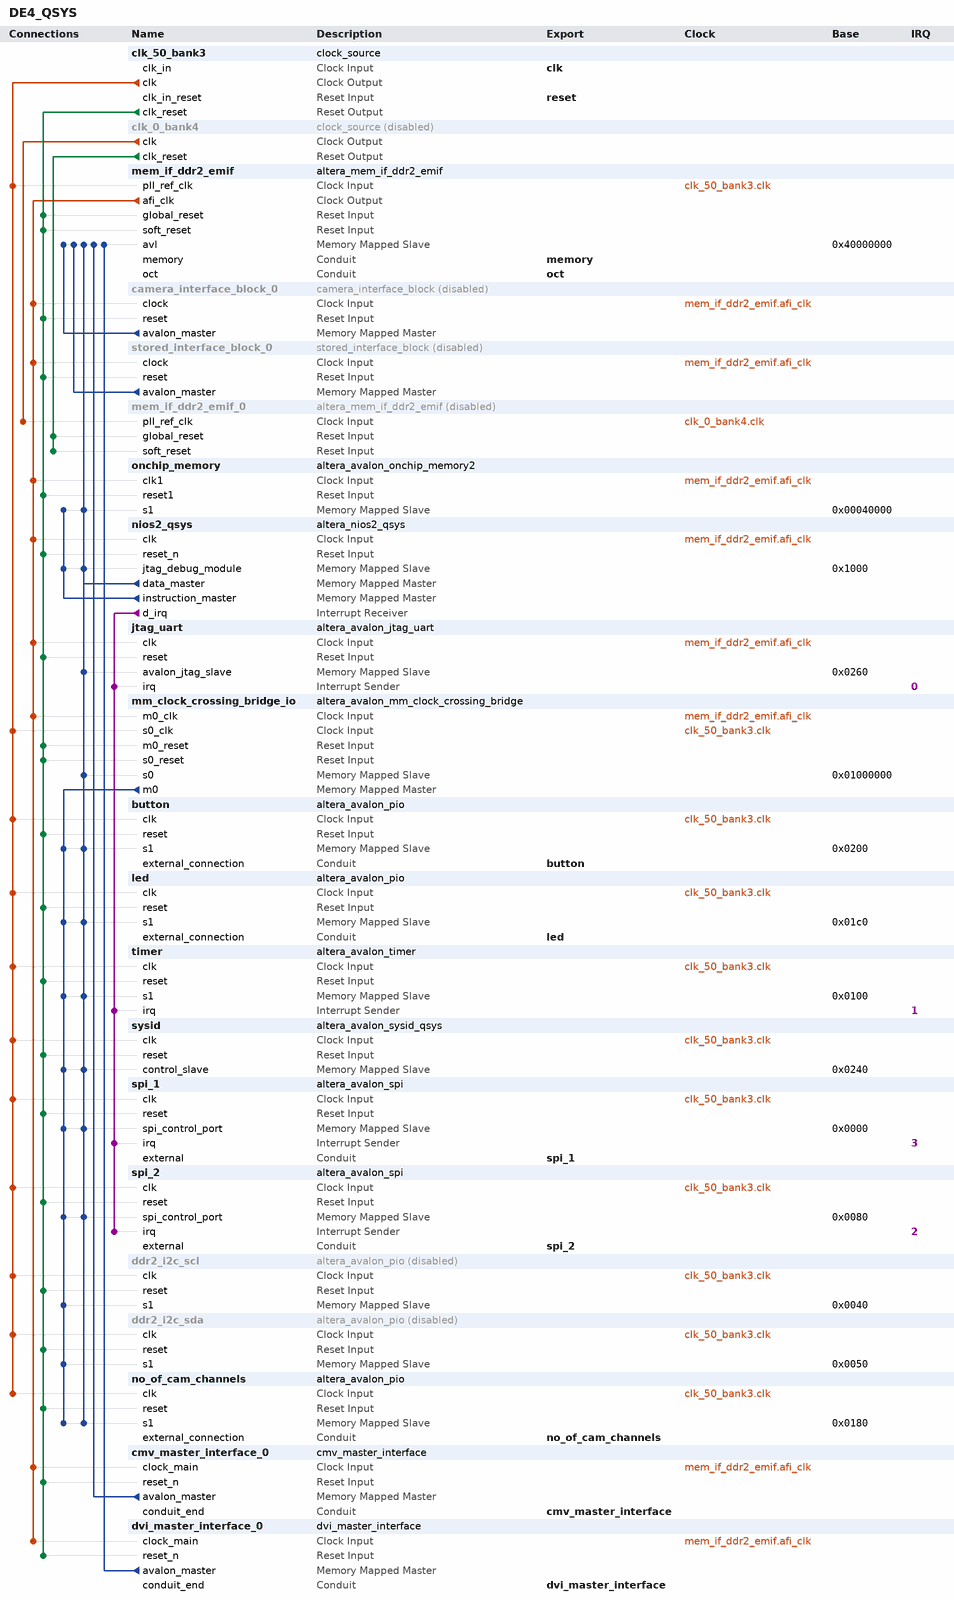
[diagram p0: system contents]
# Platform Designer (Qsys) system DE4_QSYS, Stratix IV EP4SGX230KF40C2
# Parameters at their usual value, and those the tool derives, are not listed.
package require -exact qsys 12.1
create_system DE4_QSYS
set_project_property DEVICE_FAMILY {Stratix IV}
set_project_property DEVICE EP4SGX230KF40C2

add_instance clk_50_bank3 clock_source 12.1
set_instance_parameter_value clk_50_bank3 clockFrequency 50000000

add_instance clk_0_bank4 clock_source 12.1
set_instance_property clk_0_bank4 ENABLED false
set_instance_parameter_value clk_0_bank4 clockFrequency 162000000

add_instance mem_if_ddr2_emif altera_mem_if_ddr2_emif 12.1
set_instance_parameter_value mem_if_ddr2_emif MEM_CLK_FREQ 400.0
set_instance_parameter_value mem_if_ddr2_emif MEM_ROW_ADDR_WIDTH 14
set_instance_parameter_value mem_if_ddr2_emif MEM_COL_ADDR_WIDTH 10
set_instance_parameter_value mem_if_ddr2_emif MEM_DQ_WIDTH 64
set_instance_parameter_value mem_if_ddr2_emif MEM_BANKADDR_WIDTH 3
set_instance_parameter_value mem_if_ddr2_emif MEM_NUMBER_OF_RANKS_PER_DIMM 1
set_instance_parameter_value mem_if_ddr2_emif MEM_TCL 6
set_instance_parameter_value mem_if_ddr2_emif TIMING_TIH 375
set_instance_parameter_value mem_if_ddr2_emif TIMING_TDQSQ 200
set_instance_parameter_value mem_if_ddr2_emif TIMING_TQHS 300
set_instance_parameter_value mem_if_ddr2_emif MEM_TRAS_NS 40.0
set_instance_parameter_value mem_if_ddr2_emif POWER_OF_TWO_BUS true
set_instance_parameter_value mem_if_ddr2_emif AVL_MAX_SIZE 128
set_instance_parameter_value mem_if_ddr2_emif REF_CLK_FREQ 50.0
set_instance_parameter_value mem_if_ddr2_emif DEFAULT_FAST_SIM_MODEL true
set_instance_parameter_value mem_if_ddr2_emif PLL_SHARING_MODE None
set_instance_parameter_value mem_if_ddr2_emif EXPORT_AFI_HALF_CLK false
set_instance_parameter_value mem_if_ddr2_emif CALIBRATION_MODE Full
set_instance_parameter_value mem_if_ddr2_emif USER_DEBUG_LEVEL 0
set_instance_parameter_value mem_if_ddr2_emif DLL_SHARING_MODE None

add_instance camera_interface_block_0 camera_interface_block 1.0
set_instance_property camera_interface_block_0 ENABLED false

add_instance stored_interface_block_0 stored_interface_block 1.0
set_instance_property stored_interface_block_0 ENABLED false

add_instance mem_if_ddr2_emif_0 altera_mem_if_ddr2_emif 12.1
set_instance_property mem_if_ddr2_emif_0 ENABLED false
set_instance_parameter_value mem_if_ddr2_emif_0 MEM_CLK_FREQ 400.0
set_instance_parameter_value mem_if_ddr2_emif_0 MEM_ROW_ADDR_WIDTH 13
set_instance_parameter_value mem_if_ddr2_emif_0 MEM_COL_ADDR_WIDTH 10
set_instance_parameter_value mem_if_ddr2_emif_0 MEM_DQ_WIDTH 64
set_instance_parameter_value mem_if_ddr2_emif_0 MEM_BANKADDR_WIDTH 3
set_instance_parameter_value mem_if_ddr2_emif_0 MEM_NUMBER_OF_RANKS_PER_DIMM 1
set_instance_parameter_value mem_if_ddr2_emif_0 MEM_TCL 6
set_instance_parameter_value mem_if_ddr2_emif_0 TIMING_TIH 375
set_instance_parameter_value mem_if_ddr2_emif_0 TIMING_TDQSQ 200
set_instance_parameter_value mem_if_ddr2_emif_0 TIMING_TQHS 300
set_instance_parameter_value mem_if_ddr2_emif_0 MEM_TRAS_NS 40.0
set_instance_parameter_value mem_if_ddr2_emif_0 POWER_OF_TWO_BUS false
set_instance_parameter_value mem_if_ddr2_emif_0 AVL_MAX_SIZE 4
set_instance_parameter_value mem_if_ddr2_emif_0 REF_CLK_FREQ 100.0
set_instance_parameter_value mem_if_ddr2_emif_0 DEFAULT_FAST_SIM_MODEL true
set_instance_parameter_value mem_if_ddr2_emif_0 PLL_SHARING_MODE None
set_instance_parameter_value mem_if_ddr2_emif_0 EXPORT_AFI_HALF_CLK false
set_instance_parameter_value mem_if_ddr2_emif_0 CALIBRATION_MODE Full
set_instance_parameter_value mem_if_ddr2_emif_0 USER_DEBUG_LEVEL 0
set_instance_parameter_value mem_if_ddr2_emif_0 DLL_SHARING_MODE None

add_instance onchip_memory altera_avalon_onchip_memory2 12.1
set_instance_parameter_value onchip_memory dataWidth 32
set_instance_parameter_value onchip_memory dualPort false
set_instance_parameter_value onchip_memory initMemContent true
set_instance_parameter_value onchip_memory initializationFileName onchip_memory
set_instance_parameter_value onchip_memory memorySize 128000

add_instance nios2_qsys altera_nios2_qsys 12.1
set_instance_parameter_value nios2_qsys manuallyAssignCpuID false
set_instance_parameter_value nios2_qsys resetSlave onchip_memory.s1
set_instance_parameter_value nios2_qsys exceptionSlave onchip_memory.s1
set_instance_parameter_value nios2_qsys breakSlave nios2_qsys.jtag_debug_module
set_instance_parameter_value nios2_qsys muldiv_multiplierType DSPBlock
set_instance_parameter_value nios2_qsys impl Fast
set_instance_parameter_value nios2_qsys icache_size 4096
set_instance_parameter_value nios2_qsys dcache_bursts true

add_instance jtag_uart altera_avalon_jtag_uart 12.1
set_instance_parameter_value jtag_uart allowMultipleConnections true
set_instance_parameter_value jtag_uart simInteractiveOptions INTERACTIVE_ASCII_OUTPUT

add_instance mm_clock_crossing_bridge_io altera_avalon_mm_clock_crossing_bridge 12.1
set_instance_parameter_value mm_clock_crossing_bridge_io DATA_WIDTH 32
set_instance_parameter_value mm_clock_crossing_bridge_io ADDRESS_WIDTH 10
set_instance_parameter_value mm_clock_crossing_bridge_io MAX_BURST_SIZE 1
set_instance_parameter_value mm_clock_crossing_bridge_io COMMAND_FIFO_DEPTH 4
set_instance_parameter_value mm_clock_crossing_bridge_io RESPONSE_FIFO_DEPTH 4
set_instance_parameter_value mm_clock_crossing_bridge_io MASTER_SYNC_DEPTH 2
set_instance_parameter_value mm_clock_crossing_bridge_io SLAVE_SYNC_DEPTH 2

add_instance button altera_avalon_pio 12.1
set_instance_parameter_value button direction Input
set_instance_parameter_value button width 4

add_instance led altera_avalon_pio 12.1
set_instance_parameter_value led direction Output
set_instance_parameter_value led width 8

add_instance timer altera_avalon_timer 12.1
set_instance_parameter_value timer period 1
set_instance_parameter_value timer periodUnits MSEC
set_instance_parameter_value timer timerPreset CUSTOM

add_instance sysid altera_avalon_sysid_qsys 12.1
set_instance_parameter_value sysid id 0

add_instance spi_1 altera_avalon_spi 12.1
set_instance_parameter_value spi_1 clockPolarity 0
set_instance_parameter_value spi_1 dataWidth 8
set_instance_parameter_value spi_1 masterSPI true
set_instance_parameter_value spi_1 numberOfSlaves 1
set_instance_parameter_value spi_1 targetClockRate 128000

add_instance spi_2 altera_avalon_spi 12.1
set_instance_parameter_value spi_2 clockPolarity 0
set_instance_parameter_value spi_2 dataWidth 8
set_instance_parameter_value spi_2 masterSPI true
set_instance_parameter_value spi_2 numberOfSlaves 1
set_instance_parameter_value spi_2 targetClockRate 128000

add_instance ddr2_i2c_scl altera_avalon_pio 12.1
set_instance_property ddr2_i2c_scl ENABLED false
set_instance_parameter_value ddr2_i2c_scl direction Output
set_instance_parameter_value ddr2_i2c_scl width 1

add_instance ddr2_i2c_sda altera_avalon_pio 12.1
set_instance_property ddr2_i2c_sda ENABLED false
set_instance_parameter_value ddr2_i2c_sda direction Bidir
set_instance_parameter_value ddr2_i2c_sda width 1

add_instance no_of_cam_channels altera_avalon_pio 12.1
set_instance_parameter_value no_of_cam_channels direction Output
set_instance_parameter_value no_of_cam_channels width 4

add_instance cmv_master_interface_0 cmv_master_interface 1.0

add_instance dvi_master_interface_0 dvi_master_interface 1.0

# connections
add_connection clk_0_bank4.clk mem_if_ddr2_emif_0.pll_ref_clk clock
add_connection clk_50_bank3.clk button.clk clock
add_connection clk_50_bank3.clk ddr2_i2c_scl.clk clock
add_connection clk_50_bank3.clk ddr2_i2c_sda.clk clock
add_connection clk_50_bank3.clk led.clk clock
add_connection clk_50_bank3.clk mem_if_ddr2_emif.pll_ref_clk clock
add_connection clk_50_bank3.clk mm_clock_crossing_bridge_io.s0_clk clock
add_connection clk_50_bank3.clk no_of_cam_channels.clk clock
add_connection clk_50_bank3.clk spi_1.clk clock
add_connection clk_50_bank3.clk spi_2.clk clock
add_connection clk_50_bank3.clk sysid.clk clock
add_connection clk_50_bank3.clk timer.clk clock
add_connection mem_if_ddr2_emif.afi_clk camera_interface_block_0.clock clock
add_connection mem_if_ddr2_emif.afi_clk cmv_master_interface_0.clock_main clock
add_connection mem_if_ddr2_emif.afi_clk dvi_master_interface_0.clock_main clock
add_connection mem_if_ddr2_emif.afi_clk jtag_uart.clk clock
add_connection mem_if_ddr2_emif.afi_clk mm_clock_crossing_bridge_io.m0_clk clock
add_connection mem_if_ddr2_emif.afi_clk nios2_qsys.clk clock
add_connection mem_if_ddr2_emif.afi_clk onchip_memory.clk1 clock
add_connection mem_if_ddr2_emif.afi_clk stored_interface_block_0.clock clock
add_connection clk_0_bank4.clk_reset mem_if_ddr2_emif_0.global_reset reset
add_connection clk_0_bank4.clk_reset mem_if_ddr2_emif_0.soft_reset reset
add_connection clk_50_bank3.clk_reset button.reset reset
add_connection clk_50_bank3.clk_reset camera_interface_block_0.reset reset
add_connection clk_50_bank3.clk_reset cmv_master_interface_0.reset_n reset
add_connection clk_50_bank3.clk_reset ddr2_i2c_scl.reset reset
add_connection clk_50_bank3.clk_reset ddr2_i2c_sda.reset reset
add_connection clk_50_bank3.clk_reset dvi_master_interface_0.reset_n reset
add_connection clk_50_bank3.clk_reset jtag_uart.reset reset
add_connection clk_50_bank3.clk_reset led.reset reset
add_connection clk_50_bank3.clk_reset mem_if_ddr2_emif.global_reset reset
add_connection clk_50_bank3.clk_reset mem_if_ddr2_emif.soft_reset reset
add_connection clk_50_bank3.clk_reset mm_clock_crossing_bridge_io.m0_reset reset
add_connection clk_50_bank3.clk_reset mm_clock_crossing_bridge_io.s0_reset reset
add_connection clk_50_bank3.clk_reset nios2_qsys.reset_n reset
add_connection clk_50_bank3.clk_reset no_of_cam_channels.reset reset
add_connection clk_50_bank3.clk_reset onchip_memory.reset1 reset
add_connection clk_50_bank3.clk_reset spi_1.reset reset
add_connection clk_50_bank3.clk_reset spi_2.reset reset
add_connection clk_50_bank3.clk_reset stored_interface_block_0.reset reset
add_connection clk_50_bank3.clk_reset sysid.reset reset
add_connection clk_50_bank3.clk_reset timer.reset reset
add_connection camera_interface_block_0.avalon_master mem_if_ddr2_emif.avl avalon
set_connection_parameter_value camera_interface_block_0.avalon_master/mem_if_ddr2_emif.avl arbitrationPriority 32
set_connection_parameter_value camera_interface_block_0.avalon_master/mem_if_ddr2_emif.avl baseAddress 0x40000000
add_connection cmv_master_interface_0.avalon_master mem_if_ddr2_emif.avl avalon
set_connection_parameter_value cmv_master_interface_0.avalon_master/mem_if_ddr2_emif.avl baseAddress 0x40000000
add_connection dvi_master_interface_0.avalon_master mem_if_ddr2_emif.avl avalon
set_connection_parameter_value dvi_master_interface_0.avalon_master/mem_if_ddr2_emif.avl baseAddress 0x40000000
add_connection mm_clock_crossing_bridge_io.m0 button.s1 avalon
set_connection_parameter_value mm_clock_crossing_bridge_io.m0/button.s1 baseAddress 0x0200
add_connection mm_clock_crossing_bridge_io.m0 ddr2_i2c_scl.s1 avalon
set_connection_parameter_value mm_clock_crossing_bridge_io.m0/ddr2_i2c_scl.s1 baseAddress 0x0040
add_connection mm_clock_crossing_bridge_io.m0 ddr2_i2c_sda.s1 avalon
set_connection_parameter_value mm_clock_crossing_bridge_io.m0/ddr2_i2c_sda.s1 baseAddress 0x0050
add_connection mm_clock_crossing_bridge_io.m0 led.s1 avalon
set_connection_parameter_value mm_clock_crossing_bridge_io.m0/led.s1 baseAddress 0x01c0
add_connection mm_clock_crossing_bridge_io.m0 no_of_cam_channels.s1 avalon
set_connection_parameter_value mm_clock_crossing_bridge_io.m0/no_of_cam_channels.s1 baseAddress 0x0180
add_connection mm_clock_crossing_bridge_io.m0 spi_1.spi_control_port avalon
set_connection_parameter_value mm_clock_crossing_bridge_io.m0/spi_1.spi_control_port baseAddress 0x0000
add_connection mm_clock_crossing_bridge_io.m0 spi_2.spi_control_port avalon
set_connection_parameter_value mm_clock_crossing_bridge_io.m0/spi_2.spi_control_port baseAddress 0x0080
add_connection mm_clock_crossing_bridge_io.m0 sysid.control_slave avalon
set_connection_parameter_value mm_clock_crossing_bridge_io.m0/sysid.control_slave baseAddress 0x0240
add_connection mm_clock_crossing_bridge_io.m0 timer.s1 avalon
set_connection_parameter_value mm_clock_crossing_bridge_io.m0/timer.s1 baseAddress 0x0100
add_connection nios2_qsys.data_master button.s1 avalon
set_connection_parameter_value nios2_qsys.data_master/button.s1 baseAddress 0x0200
add_connection nios2_qsys.data_master jtag_uart.avalon_jtag_slave avalon
set_connection_parameter_value nios2_qsys.data_master/jtag_uart.avalon_jtag_slave baseAddress 0x0260
add_connection nios2_qsys.data_master led.s1 avalon
set_connection_parameter_value nios2_qsys.data_master/led.s1 baseAddress 0x01c0
add_connection nios2_qsys.data_master mem_if_ddr2_emif.avl avalon
set_connection_parameter_value nios2_qsys.data_master/mem_if_ddr2_emif.avl baseAddress 0x40000000
add_connection nios2_qsys.data_master mm_clock_crossing_bridge_io.s0 avalon
set_connection_parameter_value nios2_qsys.data_master/mm_clock_crossing_bridge_io.s0 baseAddress 0x01000000
add_connection nios2_qsys.data_master nios2_qsys.jtag_debug_module avalon
set_connection_parameter_value nios2_qsys.data_master/nios2_qsys.jtag_debug_module baseAddress 0x1000
add_connection nios2_qsys.data_master no_of_cam_channels.s1 avalon
set_connection_parameter_value nios2_qsys.data_master/no_of_cam_channels.s1 baseAddress 0x0180
add_connection nios2_qsys.data_master onchip_memory.s1 avalon
set_connection_parameter_value nios2_qsys.data_master/onchip_memory.s1 baseAddress 0x00040000
add_connection nios2_qsys.data_master spi_1.spi_control_port avalon
set_connection_parameter_value nios2_qsys.data_master/spi_1.spi_control_port baseAddress 0x0000
add_connection nios2_qsys.data_master spi_2.spi_control_port avalon
set_connection_parameter_value nios2_qsys.data_master/spi_2.spi_control_port baseAddress 0x0080
add_connection nios2_qsys.data_master sysid.control_slave avalon
set_connection_parameter_value nios2_qsys.data_master/sysid.control_slave baseAddress 0x0240
add_connection nios2_qsys.data_master timer.s1 avalon
set_connection_parameter_value nios2_qsys.data_master/timer.s1 baseAddress 0x0100
add_connection nios2_qsys.instruction_master nios2_qsys.jtag_debug_module avalon
set_connection_parameter_value nios2_qsys.instruction_master/nios2_qsys.jtag_debug_module baseAddress 0x1000
add_connection nios2_qsys.instruction_master onchip_memory.s1 avalon
set_connection_parameter_value nios2_qsys.instruction_master/onchip_memory.s1 baseAddress 0x00040000
add_connection stored_interface_block_0.avalon_master mem_if_ddr2_emif.avl avalon
set_connection_parameter_value stored_interface_block_0.avalon_master/mem_if_ddr2_emif.avl arbitrationPriority 128
set_connection_parameter_value stored_interface_block_0.avalon_master/mem_if_ddr2_emif.avl baseAddress 0x40000000
add_connection nios2_qsys.d_irq jtag_uart.irq interrupt
set_connection_parameter_value nios2_qsys.d_irq/jtag_uart.irq irqNumber 0
add_connection nios2_qsys.d_irq spi_1.irq interrupt
set_connection_parameter_value nios2_qsys.d_irq/spi_1.irq irqNumber 3
add_connection nios2_qsys.d_irq spi_2.irq interrupt
set_connection_parameter_value nios2_qsys.d_irq/spi_2.irq irqNumber 2
add_connection nios2_qsys.d_irq timer.irq interrupt
set_connection_parameter_value nios2_qsys.d_irq/timer.irq irqNumber 1

# exported interfaces
add_interface clk clock sink
set_interface_property clk EXPORT_OF clk_50_bank3.clk_in
add_interface reset reset sink
set_interface_property reset EXPORT_OF clk_50_bank3.clk_in_reset
add_interface memory conduit end
set_interface_property memory EXPORT_OF mem_if_ddr2_emif.memory
add_interface oct conduit end
set_interface_property oct EXPORT_OF mem_if_ddr2_emif.oct
add_interface led conduit end
set_interface_property led EXPORT_OF led.external_connection
add_interface button conduit end
set_interface_property button EXPORT_OF button.external_connection
add_interface spi_2 conduit end
set_interface_property spi_2 EXPORT_OF spi_2.external
add_interface spi_1 conduit end
set_interface_property spi_1 EXPORT_OF spi_1.external
add_interface no_of_cam_channels conduit end
set_interface_property no_of_cam_channels EXPORT_OF no_of_cam_channels.external_connection
add_interface cmv_master_interface conduit end
set_interface_property cmv_master_interface EXPORT_OF cmv_master_interface_0.conduit_end
add_interface dvi_master_interface conduit end
set_interface_property dvi_master_interface EXPORT_OF dvi_master_interface_0.conduit_end

save_system DE4_QSYS.qsys
